# EAGLE design TSSOP-38 Breakout Board (EAGLE 9.1.3)
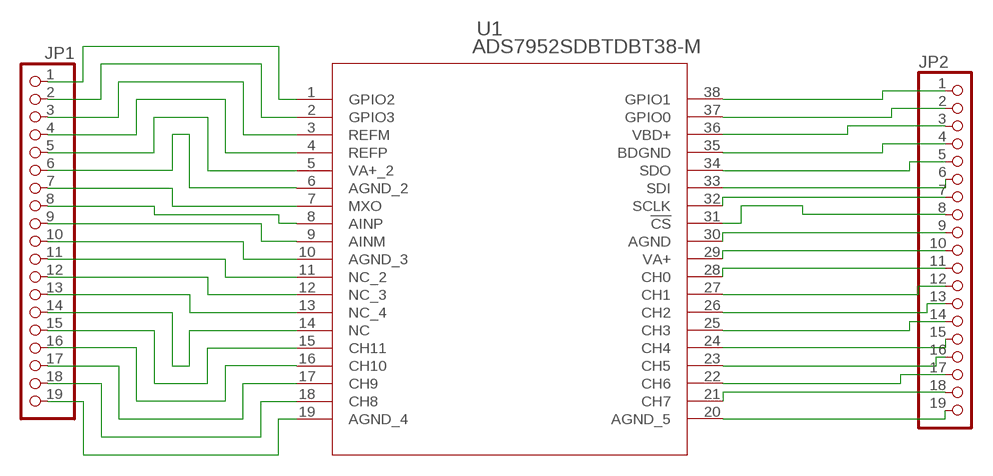
[diagram p0: schematic, sheet 1]

## Parts
JP1  PINHD-1X19  [1X19]
JP2  PINHD-1X19  [1X19]
U1  ADS7952SDBTDBT38-M  [DBT38-M]

## Nets
N$1: JP1.1 U1.1(GPIO2)
N$2: JP1.2 U1.2(GPIO3)
N$3: JP1.3 U1.3(REFM)
N$4: JP1.4 U1.4(REFP)
N$5: JP1.5 U1.5(VA+_2)
N$6: JP1.6 U1.6(AGND_2)
N$7: JP1.7 U1.7(MXO)
N$8: JP1.8 U1.8(AINP)
N$9: JP1.19 U1.19(AGND_4)
N$10: JP1.18 U1.18(CH8)
N$11: JP1.17 U1.17(CH9)
N$12: JP1.16 U1.16(CH10)
N$13: JP1.15 U1.15(CH11)
N$14: JP1.14 U1.14(NC)
N$15: JP1.13 U1.13(NC_4)
N$16: JP1.12 U1.12(NC_3)
N$17: JP1.11 U1.11(NC_2)
N$18: JP1.10 U1.10(AGND_3)
N$19: JP1.9 U1.9(AINM)
N$20: JP2.1 U1.38(GPIO1)
N$21: JP2.2 U1.37(GPIO0)
N$22: JP2.3 U1.36(VBD+)
N$23: JP2.4 U1.35(BDGND)
N$24: JP2.5 U1.34(SDO)
N$25: JP2.6 U1.33(SDI)
N$26: JP2.7 U1.32(SCLK)
N$27: JP2.8 U1.31(!CS)
N$28: JP2.9 U1.30(AGND)
N$29: JP2.10 U1.29(VA+)
N$30: JP2.11 U1.28(CH0)
N$31: JP2.12 U1.27(CH1)
N$32: JP2.13 U1.26(CH2)
N$33: JP2.14 U1.25(CH3)
N$34: JP2.15 U1.24(CH4)
N$35: JP2.16 U1.23(CH5)
N$36: JP2.17 U1.22(CH6)
N$37: JP2.18 U1.21(CH7)
N$38: JP2.19 U1.20(AGND_5)

## Library data of the parts
JP1 JP2 = pinhead:PINHD-1X19: PIN HEADER
U1 = ADS7952:ADS7952SDBT; MANUFACTURER_PART_NUMBER: ADS7952SDBT; VENDOR: Texas Instruments

## Net classes
0 default: width 0.305 mm, clearance 0.152 mm

## Board
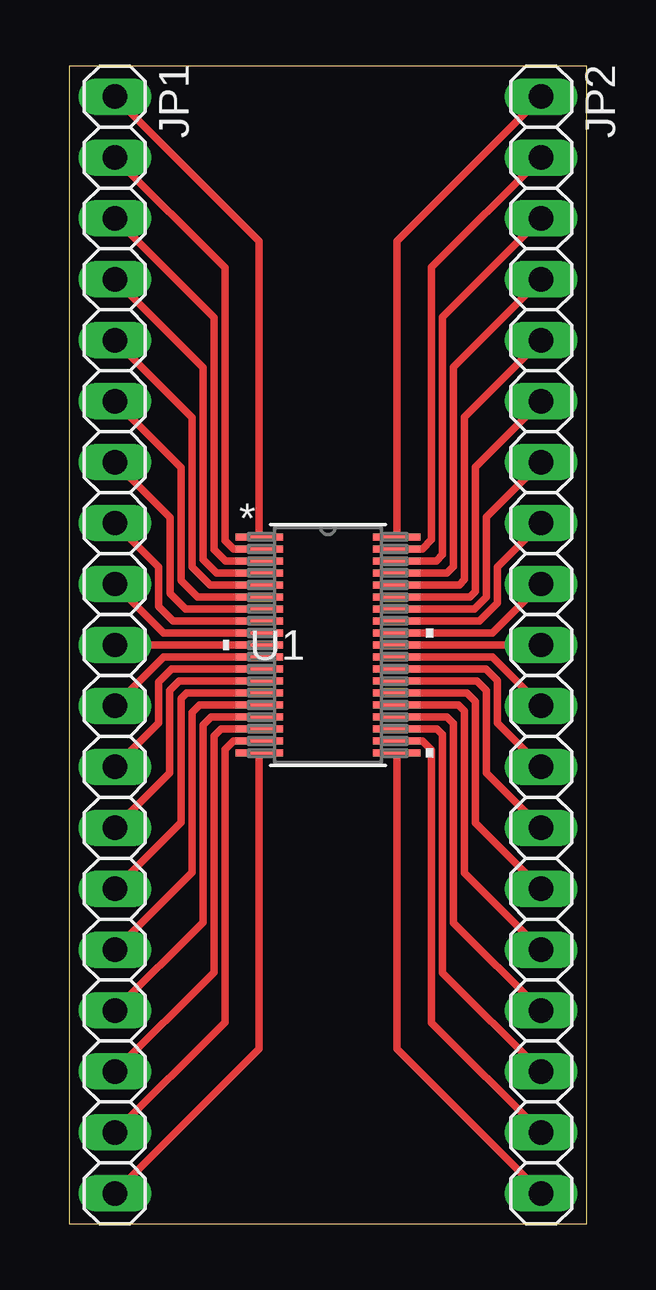
[diagram p1: board, top side]

Size 21.59 x 48.26 mm. Coordinates in mm from the lower left corner, seen from the top.
Outline: 0,0 21.59,0 21.59,48.26 0,48.26 0,0
Copper layers (1*16): Top 0.035mm / dielectric 1.5mm / Bottom 0.035mm
Design rules "DRC Advanced Circuits": minimum track width 6mil, minimum drill 15mil, track to track 6mil, track to pad 6mil, pad to pad 6mil, via to via 6mil, smd to smd 6mil, copper to edge 40mil, drill to drill 6mil, minimum pad ring 10mil, minimum via ring 8mil, stop-mask expansion 4mil, vias tented up to drill 0mil, thermal gap 10mil

### Footprints (pad centres in the part's own frame; a part is rotated, then mirrored left to right if it is on the bottom)
1X19 = drill 1.016 long: 1 -22.86,0; 2 -20.32,0; 3 -17.78,0; 4 -15.24,0; 5 -12.7,0; 6 -10.16,0; 7 -7.62,0; 8 -5.08,0; 9 -2.54,0; 10 0,0; 11 2.54,0; 12 5.08,0; 13 7.62,0; 14 10.16,0; 15 12.7,0; 16 15.24,0; 17 17.78,0; 18 20.32,0; 19 22.86,0
DBT38-M = smd 1.981 x 0.279: 1 -2.87,4.5; 2 -2.87,4; 3 -2.87,3.5; 4 -2.87,3; 5 -2.87,2.5; 6 -2.87,2; 7 -2.87,1.5; 8 -2.87,1; 9 -2.87,0.5; 10 -2.87,0; 11 -2.87,-0.5; 12 -2.87,-1; 13 -2.87,-1.5; 14 -2.87,-2; 15 -2.87,-2.5; 16 -2.87,-3; 17 -2.87,-3.5; 18 -2.87,-4; 19 -2.87,-4.5; 20 2.87,-4.5; 21 2.87,-4; 22 2.87,-3.5; 23 2.87,-3; 24 2.87,-2.5; 25 2.87,-2; 26 2.87,-1.5; 27 2.87,-1; 28 2.87,-0.5; 29 2.87,0; 30 2.87,0.5; 31 2.87,1; 32 2.87,1.5; 33 2.87,2; 34 2.87,2.5; 35 2.87,3; 36 2.87,3.5; 37 2.87,4; 38 2.87,4.5

### Placement (x,y rotation side)
JP1  1.91,24.13 270 top
JP2  19.68,24.13 270 top
U1  10.79,24.13 0 top

### Tracks (layer width: path | path; a pad name or v marks a point on that pad's centre or on a via)
N$1
  Top 0.305: U1.1 7.92,40.97 JP1.1
N$2
  Top 0.305: JP1.2 6.5,39.85 6.5,28.49 6.86,28.13 U1.2
N$3
  Top 0.305: U1.3 6.53,27.63 6.04,28.12 6.04,37.77 JP1.3
N$4
  Top 0.305: U1.4 6.14,27.13 5.59,27.69 5.59,35.69 JP1.4
N$5
  Top 0.305: U1.5 5.88,26.63 5.13,27.38 5.13,33.6 JP1.5
N$6
  Top 0.305: U1.6 5.37,26.13 4.67,26.82 4.67,31.52 JP1.6
N$7
  Top 0.305: U1.7 4.85,25.63 4.2,26.28 4.2,29.45 JP1.7
N$8
  Top 0.305: U1.8 4.83,25.13 4.33,25.13 3.73,25.73 3.73,27.38 JP1.8
N$9
  Top 0.305: U1.19 7.92,7.29 JP1.19
N$10
  Top 0.305: U1.18 6.86,20.13 6.5,19.77 6.5,8.41 JP1.18
N$11
  Top 0.305: U1.17 6.33,20.63 6.04,20.34 6.04,10.49 JP1.17
N$12
  Top 0.305: U1.16 5.92,21.13 5.59,20.8 5.59,12.57 JP1.16
N$13
  Top 0.305: U1.15 5.45,21.63 5.13,21.31 5.13,14.66 JP1.15
N$14
  Top 0.305: U1.14 4.91,22.13 4.67,21.89 4.67,16.74 JP1.14
N$15
  Top 0.305: U1.13 4.6,22.63 4.19,22.23 4.19,18.8 JP1.13
N$16
  Top 0.305: U1.12 4.28,23.13 3.73,22.58 3.73,20.88 JP1.12
N$17
  Top 0.305: U1.11 3.94,23.63 JP1.11
N$18
  Top 0.305: U1.10 JP1.10
N$19
  Top 0.305: U1.9 3.94,24.63 JP1.9
N$20
  Top 0.305: U1.38 13.66,40.97 JP2.1
N$21
  Top 0.305: JP2.2 15.11,39.88 15.11,28.52 14.73,28.13 U1.37
N$22
  Top 0.305: U1.36 15.31,27.63 15.57,27.89 15.57,37.8 JP2.3
N$23
  Top 0.305: U1.35 15.75,27.13 16.03,27.41 16.03,35.71 JP2.4
N$24
  Top 0.305: U1.34 16.27,26.63 16.48,26.85 16.48,33.63 JP2.5
N$25
  Top 0.305: U1.33 16.71,26.13 16.94,26.36 16.94,31.55 JP2.6
N$26
  Top 0.305: U1.32 16.89,25.63 17.4,26.14 17.4,29.46 JP2.7
N$27
  Top 0.305: U1.31 17.1,25.13 17.86,25.88 17.86,27.38 JP2.8
N$28
  Top 0.305: U1.30 17.64,24.63 JP2.9
N$29
  Top 0.305: U1.29 JP2.10
N$30
  Top 0.305: U1.28 17.64,23.63 JP2.11
N$31
  Top 0.305: U1.27 17.38,23.13 17.86,22.66 17.86,20.88 JP2.12
N$32
  Top 0.305: U1.26 16.99,22.63 17.4,22.23 17.4,18.8 JP2.13
N$33
  Top 0.305: U1.25 16.58,22.13 16.94,21.77 16.94,16.71 JP2.14
N$34
  Top 0.305: U1.24 16.24,21.63 16.48,21.39 16.48,14.63 JP2.15
N$35
  Top 0.305: U1.23 15.75,21.13 16.03,20.85 16.03,12.55 JP2.16
N$36
  Top 0.305: U1.22 15.34,20.63 15.57,20.4 15.57,10.46 JP2.17
N$37
  Top 0.305: U1.21 14.73,20.13 15.11,19.74 15.11,8.38 JP2.18
N$38
  Top 0.305: U1.20 13.66,7.29 JP2.19

### Text on the board
tDocu: HyTech Racing | TSSOP-38 | Breakout